# Altium schematic sheet Mainboard_ThermistorAmp.SchDoc
size A
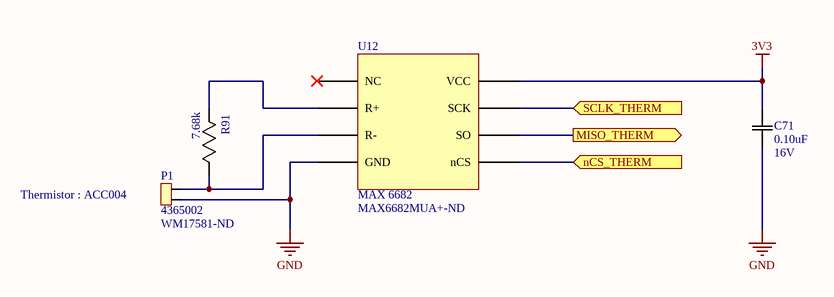
[diagram p0: Mainboard_ThermistorAmp.SchDoc]

## Parts
C71  Rating: 16V  [0603]  (hidden comment: 0.10uF)
P1  4365002  Supplier Part Number 2: WM17581-ND  [43650-02]
R91  7.68k  [0805]
U12  MAX 6682  Supplier Part Number 1: MAX6682MUA+-ND  [8-MSOP]

## Ports
MISO_THERM (out), nCS_THERM (in), SCLK_THERM (in)

## Nets
3V3: C71.1(C1) U12.8(VCC)
GND: C71.2(C2) P1.1 U12.4(GND)
MISO_THERM: U12.6(SO) ; port MISO_THERM
nCS_THERM: U12.5(nCS) ; port nCS_THERM
SCLK_THERM: U12.7(SCK) ; port SCLK_THERM
NetP1_2: P1.2 R91.1(R1) U12.3(R-)
NetR91_2: R91.2(R2) U12.2(R+)

Not connected (* = marked no-connect by the designer): U12 1(NC)*

## Notes on the sheet
- (near P1) Thermistor : ACC004

## Library data of the parts
C71 = CAP 0.10uF 16V: CAP CER 0.10UF 16V X5R 0603/0805; Tolerance: 10%; Package: 0603/0805; Temperature Coefficient: X5R; Operating Temperature: -55°C ~ 85°C; Value: 0.10uF
P1 = CN MOLEX 4365002XX: MOLEX MICROFIT 2CKT RIGHT THRU; MF: MOLEX; MP: 4365002XX; Digikey: WM17581-ND; Digikey Link: https://www.digikey.com/en/products/detail/molex/0436500205/3310532?s=N4IgTCBcDaICwGYBsBWADGsaUgLoF8g; Package: Microfit; Price: 1.44 CAD; Value: N/A; Supplier 1: Digi-Key
R91 = RES 7.68k 0.15W: RES SMD 7.68K OHM 0.1% 0.15W 0805; Power (Watts): 0.125W; Tolerance: 5%; Package: 0805; Value: 7.68k
U12 = MAX 6682: MAX 6685 Thermistor - SPI converter, 8bit; Supplier 1: Digi-Key